# Altium schematic sheet 701_USBHub-Grid-Part2.SchDoc: USB Hub Grid Connections Part 2
size A2; Organization: Greenfield Tech Solutions; Address1: Molendreef 33; Address2: Ossendrecht; Address3: 4641CS; Address4: The Netherlands; SheetNumber: 8; SheetTotal: 9
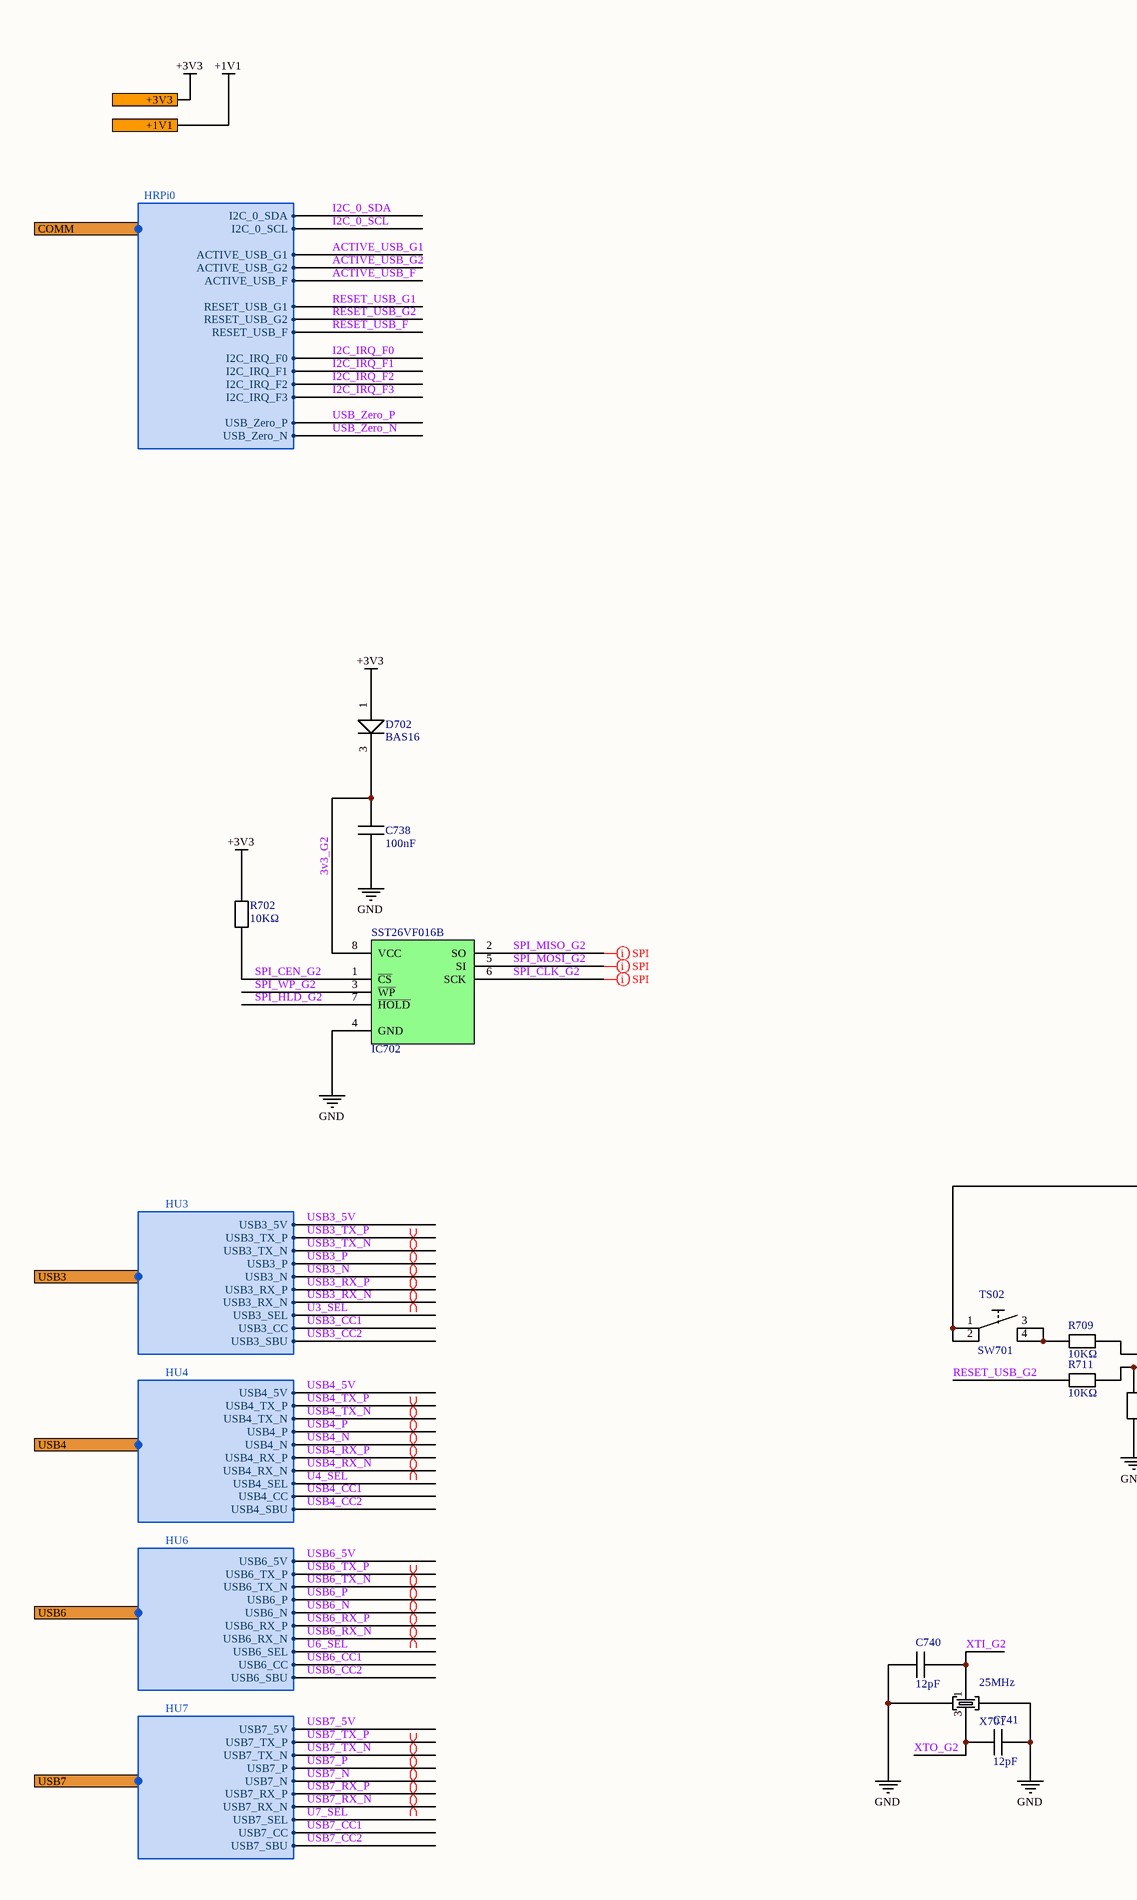
[diagram p0: 701_USBHub-Grid-Part2.SchDoc, left]
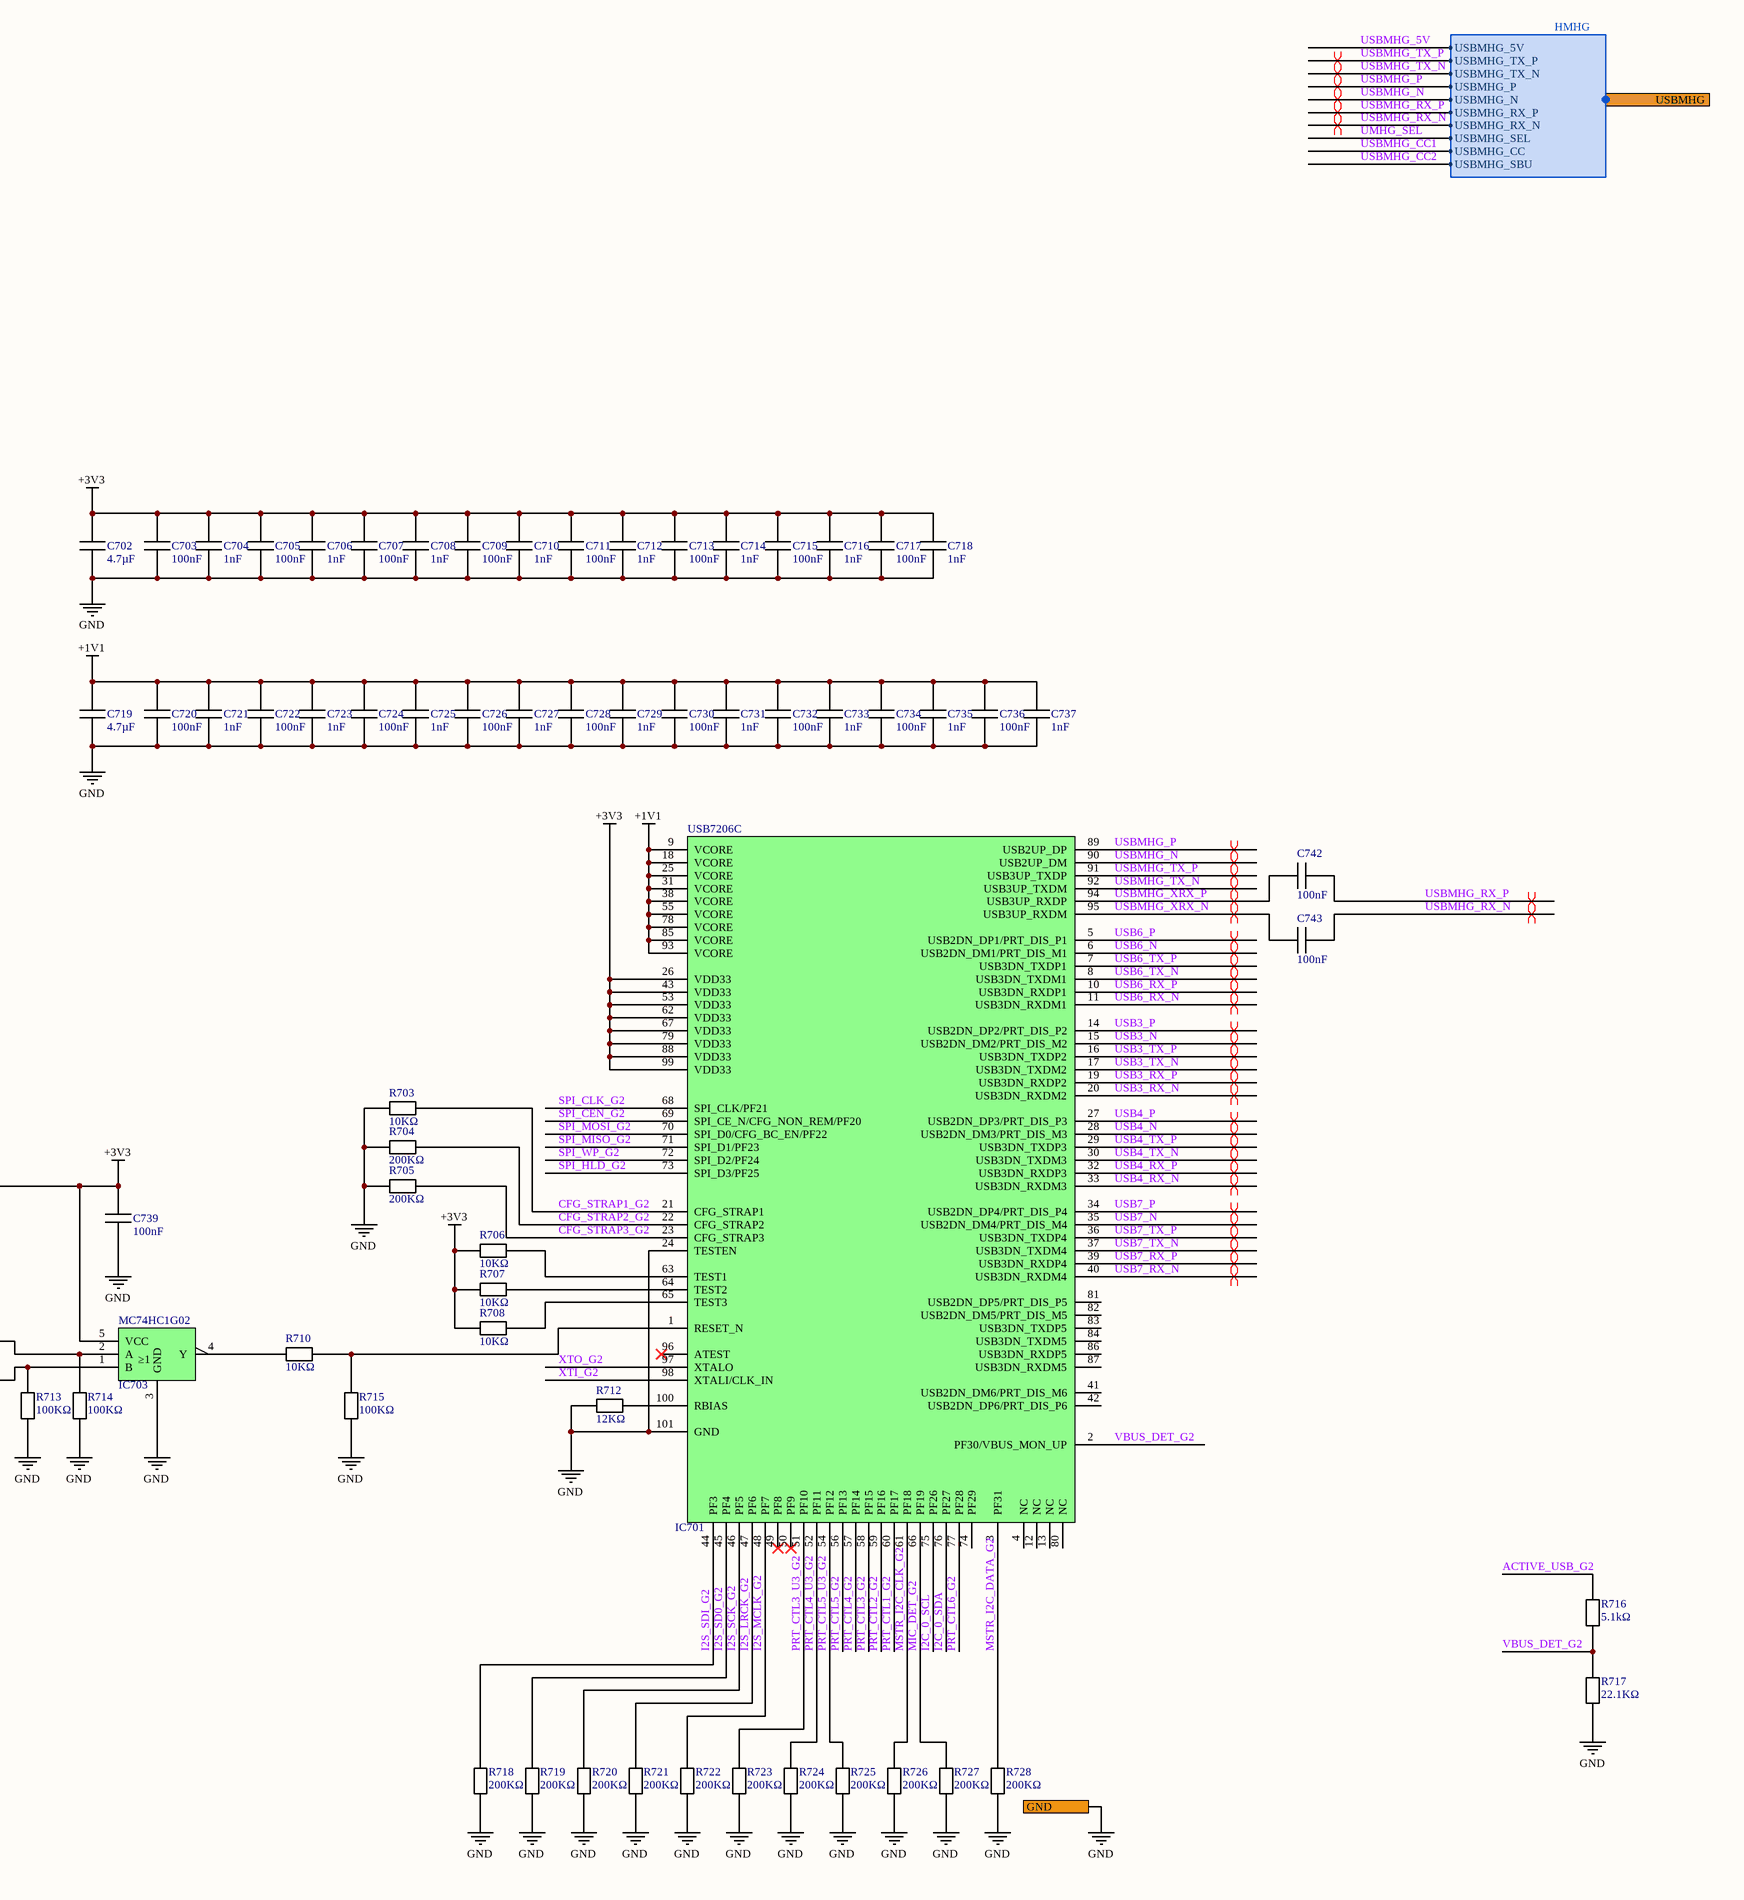
[diagram p1: 701_USBHub-Grid-Part2.SchDoc, right]

## Parts
C702  4.7µF  [C0603]
C703  100nF  [C0402]
C704  1nF  [C0402]
C705  100nF  [C0402]
C706  1nF  [C0402]
C707  100nF  [C0402]
C708  1nF  [C0402]
C709  100nF  [C0402]
C710  1nF  [C0402]
C711  100nF  [C0402]
C712  1nF  [C0402]
C713  100nF  [C0402]
C714  1nF  [C0402]
C715  100nF  [C0402]
C716  1nF  [C0402]
C717  100nF  [C0402]
C718  1nF  [C0402]
C719  4.7µF  [C0603]
C720  100nF  [C0402]
C721  1nF  [C0402]
C722  100nF  [C0402]
C723  1nF  [C0402]
C724  100nF  [C0402]
C725  1nF  [C0402]
C726  100nF  [C0402]
C727  1nF  [C0402]
C728  100nF  [C0402]
C729  1nF  [C0402]
C730  100nF  [C0402]
C731  1nF  [C0402]
C732  100nF  [C0402]
C733  1nF  [C0402]
C734  100nF  [C0402]
C735  1nF  [C0402]
C736  100nF  [C0402]
C737  1nF  [C0402]
C738  100nF  [C0402]
C739  100nF  [C0402]
C740  12pF  [C0402]
C741  12pF  [C0402]
C742  100nF  [C0402]
C743  100nF  [C0402]
D702  BAS16  [SOT-23]
IC701  USB7206C  [VQFN-100G_12X12]
IC702  SST26VF016B  [SO-8]
IC703  MC74HC1G02  [TSOP-5]
R702  10KΩ  [R0402]
R703  10KΩ  [R0402]
R704  200KΩ  [R0402]
R705  200KΩ  [R0402]
R706  10KΩ  [R0402]
R707  10KΩ  [R0402]
R708  10KΩ  [R0402]
R709  10KΩ  [R0402]
R710  10KΩ  [R0402]
R711  10KΩ  [R0402]
R712  12KΩ  [R0402]
R713  100KΩ  [R0402]
R714  100KΩ  [R0402]
R715  100KΩ  [R0402]
R716  5.1kΩ  [R0402]
R717  22.1KΩ  [R0603]
R718  200KΩ  [R0402]
R719  200KΩ  [R0402]
R720  200KΩ  [R0402]
R721  200KΩ  [R0402]
R722  200KΩ  [R0402]
R723  200KΩ  [R0402]
R724  200KΩ  [R0402]
R725  200KΩ  [R0402]
R726  200KΩ  [R0402]
R727  200KΩ  [R0402]
R728  200KΩ  [R0402]
SW701  TS02  [TS02]
X701  25MHz  [403W]

## Ports
+1V1, +3V3, COMM (harness HRPi0), GND, USB3 (harness HU3), USB4 (harness HU4), USB6 (harness HU6), USB7 (harness HU7), USBMHG (harness HMHG)

## Harnesses
HU4: USB4_5V, USB4_TX_P, USB4_TX_N, USB4_N, USB4_RX_P, USB4_RX_N, USB4_SEL, USB4_P, USB4_CC, USB4_SBU
HU7: USB7_5V, USB7_TX_P, USB7_TX_N, USB7_N, USB7_RX_P, USB7_RX_N, USB7_SEL, USB7_P, USB7_CC, USB7_SBU
HU6: USB6_5V, USB6_TX_P, USB6_TX_N, USB6_N, USB6_RX_P, USB6_RX_N, USB6_SEL, USB6_P, USB6_CC, USB6_SBU
HMHG: USBMHG_5V, USBMHG_TX_P, USBMHG_TX_N, USBMHG_N, USBMHG_RX_P, USBMHG_RX_N, USBMHG_SEL, USBMHG_P, USBMHG_CC, USBMHG_SBU
HU3: USB3_5V, USB3_TX_P, USB3_TX_N, USB3_N, USB3_RX_P, USB3_RX_N, USB3_SEL, USB3_P, USB3_CC, USB3_SBU
HRPi0: I2C_0_SCL, I2C_0_SDA, I2C_IRQ_F0, I2C_IRQ_F1, I2C_IRQ_F3, I2C_IRQ_F2, ACTIVE_USB_G1, ACTIVE_USB_F, ACTIVE_USB_G2, RESET_USB_G1, RESET_USB_F, RESET_USB_G2, USB_Zero_N, USB_Zero_P

## Nets
+1V1: C719.1 C720.1 C721.1 C722.1 C723.1 C724.1 C725.1 C726.1 C727.1 C728.1 C729.1 C730.1 C731.1 C732.1 C733.1 C734.1 C735.1 C736.1 C737.1 IC701.9(VCORE) IC701.18(VCORE) IC701.25(VCORE) IC701.31(VCORE) IC701.38(VCORE) IC701.55(VCORE) IC701.78(VCORE) IC701.85(VCORE) IC701.93(VCORE) ; port +1V1
+3V3: C702.1 C703.1 C704.1 C705.1 C706.1 C707.1 C708.1 C709.1 C710.1 C711.1 C712.1 C713.1 C714.1 C715.1 C716.1 C717.1 C718.1 C739.1 D702.1(A) IC701.26(VDD33) IC701.43(VDD33) IC701.53(VDD33) IC701.62(VDD33) IC701.67(VDD33) IC701.79(VDD33) IC701.88(VDD33) IC701.99(VDD33) IC703.5(VCC) R702.2 R706.1 R707.1 R708.1 SW701.1 SW701.2 ; port +3V3
GND: C702.2 C703.2 C704.2 C705.2 C706.2 C707.2 C708.2 C709.2 C710.2 C711.2 C712.2 C713.2 C714.2 C715.2 C716.2 C717.2 C718.2 C719.2 C720.2 C721.2 C722.2 C723.2 C724.2 C725.2 C726.2 C727.2 C728.2 C729.2 C730.2 C731.2 C732.2 C733.2 C734.2 C735.2 C736.2 C737.2 C738.2 C739.2 C740.1 C741.2 IC701.24(TESTEN) IC701.101(GND) IC702.4(GND) IC703.3(GND) R703.2 R704.1 R705.1 R712.1 R713.1 R714.1 R715.1 R717.1 R718.1 R719.1 R720.1 R721.1 R722.1 R723.1 R724.1 R725.1 R726.1 R727.1 R728.1 X701.2 X701.4 ; port GND
3v3_G2: C738.1 D702.3(K) IC702.8(VCC)
ACTIVE_USB_F: port COMM.ACTIVE_USB_F
ACTIVE_USB_G1: port COMM.ACTIVE_USB_G1
ACTIVE_USB_G2: R716.2 ; port COMM.ACTIVE_USB_G2
CFG_STRAP1_G2: IC701.21(CFG_STRAP1) R703.1
CFG_STRAP2_G2: IC701.22(CFG_STRAP2) R704.2
CFG_STRAP3_G2: IC701.23(CFG_STRAP3) R705.2
I2C_0_SCL: IC701.75(PF26) ; port COMM.I2C_0_SCL
I2C_0_SDA: IC701.76(PF27) ; port COMM.I2C_0_SDA
I2C_IRQ_F0: port COMM.I2C_IRQ_F0
I2C_IRQ_F1: port COMM.I2C_IRQ_F1
I2C_IRQ_F2: port COMM.I2C_IRQ_F2
I2C_IRQ_F3: port COMM.I2C_IRQ_F3
I2S_LRCK_G2: IC701.47(PF6) R721.2
I2S_MCLK_G2: IC701.48(PF7) R722.2
I2S_SCK_G2: IC701.46(PF5) R720.2
I2S_SD0_G2: IC701.45(PF4) R719.2
I2S_SDI_G2: IC701.44(PF3) R718.2
MIC_DET_G2: IC701.66(PF19) R727.2
MSTR_I2C_CLK_G2: IC701.61(PF18) R726.2
MSTR_I2C_DATA_G2: IC701.3(PF31) R728.2
PRT_CTL1_G2: IC701.60(PF17)
PRT_CTL2_G2: IC701.59(PF16)
PRT_CTL3_G2: IC701.58(PF15)
PRT_CTL3_U3_G2: IC701.51(PF10) R723.2
PRT_CTL4_G2: IC701.57(PF14)
PRT_CTL4_U3_G2: IC701.52(PF11) R724.2
PRT_CTL5_G2: IC701.56(PF13)
PRT_CTL5_U3_G2: IC701.54(PF12) R725.2
PRT_CTL6_G2: IC701.77(PF28)
RESET_USB_F: port COMM.RESET_USB_F
RESET_USB_G1: port COMM.RESET_USB_G1
RESET_USB_G2: R711.2 ; port COMM.RESET_USB_G2
SPI_CEN_G2: IC701.69(SPI_CE_N/CFG_NON_REM/PF20) IC702.1(~{CS}) R702.1
SPI_CLK_G2: IC701.68(SPI_CLK/PF21) IC702.6(SCK)
SPI_HLD_G2: IC701.73(SPI_D3/PF25) IC702.7(~{HOLD})
SPI_MISO_G2: IC701.71(SPI_D1/PF23) IC702.2(SO)
SPI_MOSI_G2: IC701.70(SPI_D0/CFG_BC_EN/PF22) IC702.5(SI)
SPI_WP_G2: IC701.72(SPI_D2/PF24) IC702.3(~{WP})
U3_SEL: port USB3.USB3_SEL
U4_SEL: port USB4.USB4_SEL
U6_SEL: port USB6.USB6_SEL
U7_SEL: port USB7.USB7_SEL
UMHG_SEL: port USBMHG.USBMHG_SEL
USB3_5V: port USB3.USB3_5V
USB3_CC1: port USB3.USB3_CC
USB3_CC2: port USB3.USB3_SBU
USB3_N: IC701.15(USB2DN_DM2/PRT_DIS_M2) ; port USB3.USB3_N
USB3_P: IC701.14(USB2DN_DP2/PRT_DIS_P2) ; port USB3.USB3_P
USB3_RX_N: IC701.20(USB3DN_RXDM2) ; port USB3.USB3_RX_N
USB3_RX_P: IC701.19(USB3DN_RXDP2) ; port USB3.USB3_RX_P
USB3_TX_N: IC701.17(USB3DN_TXDM2) ; port USB3.USB3_TX_N
USB3_TX_P: IC701.16(USB3DN_TXDP2) ; port USB3.USB3_TX_P
USB4_5V: port USB4.USB4_5V
USB4_CC1: port USB4.USB4_CC
USB4_CC2: port USB4.USB4_SBU
USB4_N: IC701.28(USB2DN_DM3/PRT_DIS_M3) ; port USB4.USB4_N
USB4_P: IC701.27(USB2DN_DP3/PRT_DIS_P3) ; port USB4.USB4_P
USB4_RX_N: IC701.33(USB3DN_RXDM3) ; port USB4.USB4_RX_N
USB4_RX_P: IC701.32(USB3DN_RXDP3) ; port USB4.USB4_RX_P
USB4_TX_N: IC701.30(USB3DN_TXDM3) ; port USB4.USB4_TX_N
USB4_TX_P: IC701.29(USB3DN_TXDP3) ; port USB4.USB4_TX_P
USB6_5V: port USB6.USB6_5V
USB6_CC1: port USB6.USB6_CC
USB6_CC2: port USB6.USB6_SBU
USB6_N: IC701.6(USB2DN_DM1/PRT_DIS_M1) ; port USB6.USB6_N
USB6_P: IC701.5(USB2DN_DP1/PRT_DIS_P1) ; port USB6.USB6_P
USB6_RX_N: IC701.11(USB3DN_RXDM1) ; port USB6.USB6_RX_N
USB6_RX_P: IC701.10(USB3DN_RXDP1) ; port USB6.USB6_RX_P
USB6_TX_N: IC701.8(USB3DN_TXDM1) ; port USB6.USB6_TX_N
USB6_TX_P: IC701.7(USB3DN_TXDP1) ; port USB6.USB6_TX_P
USB7_5V: port USB7.USB7_5V
USB7_CC1: port USB7.USB7_CC
USB7_CC2: port USB7.USB7_SBU
USB7_N: IC701.35(USB2DN_DM4/PRT_DIS_M4) ; port USB7.USB7_N
USB7_P: IC701.34(USB2DN_DP4/PRT_DIS_P4) ; port USB7.USB7_P
USB7_RX_N: IC701.40(USB3DN_RXDM4) ; port USB7.USB7_RX_N
USB7_RX_P: IC701.39(USB3DN_RXDP4) ; port USB7.USB7_RX_P
USB7_TX_N: IC701.37(USB3DN_TXDM4) ; port USB7.USB7_TX_N
USB7_TX_P: IC701.36(USB3DN_TXDP4) ; port USB7.USB7_TX_P
USB_Zero_N: port COMM.USB_Zero_N
USB_Zero_P: port COMM.USB_Zero_P
USBMHG_5V: port USBMHG.USBMHG_5V
USBMHG_CC1: port USBMHG.USBMHG_CC
USBMHG_CC2: port USBMHG.USBMHG_SBU
USBMHG_N: IC701.90(USB2UP_DM) ; port USBMHG.USBMHG_N
USBMHG_P: IC701.89(USB2UP_DP) ; port USBMHG.USBMHG_P
USBMHG_RX_N: C743.2 ; port USBMHG.USBMHG_RX_N
USBMHG_RX_P: C742.2 ; port USBMHG.USBMHG_RX_P
USBMHG_TX_N: IC701.92(USB3UP_TXDM) ; port USBMHG.USBMHG_TX_N
USBMHG_TX_P: IC701.91(USB3UP_TXDP) ; port USBMHG.USBMHG_TX_P
USBMHG_XRX_N: C743.1 IC701.95(USB3UP_RXDM)
USBMHG_XRX_P: C742.1 IC701.94(USB3UP_RXDP)
VBUS_DET_G2: IC701.2(PF30/VBUS_MON_UP) R716.1 R717.2
XTI_G2: C740.2 IC701.98(XTALI/CLK_IN) X701.1
XTO_G2: C741.1 IC701.97(XTALO) X701.3
NetIC701_1: IC701.1(RESET_N) R710.2 R715.2
NetIC701_63: IC701.63(TEST1) R706.2
NetIC701_64: IC701.64(TEST2) R707.2
NetIC701_65: IC701.65(TEST3) R708.2
NetIC701_100: IC701.100(RBIAS) R712.2
NetIC703_1: IC703.1(B) R711.1 R713.2
NetIC703_2: IC703.2(A) R709.1 R714.2
NetIC703_4: IC703.4(Y) R710.1
NetR709_2: R709.2 SW701.3 SW701.4

Not connected (* = marked no-connect by the designer): IC701 4(NC) 12(NC) 13(NC) 41(USB2DN_DM6/PRT_DIS_M6) 42(USB2DN_DP6/PRT_DIS_P6) 49(PF8)* 50(PF9)* 74(PF29) 80(NC) 81(USB2DN_DP5/PRT_DIS_P5) 82(USB2DN_DM5/PRT_DIS_M5) 83(USB3DN_TXDP5) 84(USB3DN_TXDM5) 86(USB3DN_RXDP5) 87(USB3DN_RXDM5) 96(ATEST)*

## Layout directives
differential pair; differential pair class USB3: USB3_N, USB3_P, USB3_RX_N, USB3_RX_P, USB3_TX_N, USB3_TX_P, USB4_N, USB4_P, USB4_RX_N, USB4_RX_P, USB4_TX_N, USB4_TX_P, USB6_N, USB6_P, USB6_RX_N, USB6_RX_P, USB6_TX_N, USB6_TX_P, USB7_N, USB7_P, USB7_RX_N, USB7_RX_P, USB7_TX_N, USB7_TX_P, USBMHG_N, USBMHG_P, USBMHG_RX_N, USBMHG_RX_P, USBMHG_TX_N, USBMHG_TX_P, USBMHG_XRX_N, USBMHG_XRX_P
net class SPI_GRID2: SPI_CLK_G2, SPI_MISO_G2, SPI_MOSI_G2

## Notes on the sheet
- Title
- Size:
- Date:
- File:
- A2
- Number:
- Time:
- Revision:
- Sheet
- of
- (in symbol IC0061) ≥1

## Library data of the parts
C702 C719 = CA0002: 4.7µF 16V 10% X5R; Part Number: CA0002; ManfactPart: C1608X5R1C475K080AC; ID: 2; RefVal: 4.7µF
C703 C705 C707 C709 C711 C713 C715 C717 C720 C722 C724 C726 C728 C730 C732 C734 C736 C738 C739 C742 C743 = CA0010: 100nF 16V 10% X7R; Part Number: CA0010; ManfactPart: GCM155R71C104KA55D; ID: 10; RefVal: 100nF
C704 C706 C708 C710 C712 C714 C716 C718 C721 C723 C725 C727 C729 C731 C733 C735 C737 = CA0031: 1nF 50V 1% C0G; Part Number: CA0031; ManfactPart: GRT1555C1H102FA02D; ID: 31; RefVal: 1nF
C740 C741 = CA0059: 12pF 16V 1% C0G; Part Number: CA0059; ManfactPart: VJ0402A120FXJCW1BC; ID: 59; RefVal: 12pF
D702 = DI0010: Diodes - General Purpose, Power, Switching 100Vll Signal Switching Diodes 2A; Part Number: DI0010; ManfactPart: BAS16_R1_00001; ID: 10; RefVal: BAS16
IC701 = IC0065: 6-Port USB 3.2 Gen 2 Controller Hub; Part Number: IC0065; ID: 65; RefVal: USB7206C; ManfactPart: USB7206C
IC702 = IC0059: 16 Mbit Serial Quad I/O (SQI) Flash Memory; Part Number: IC0059; ManfactPart: SST26VF016B-104I/SM; ID: 59; RefVal: SST26VF016B
IC703 = IC0061: Logic Gates 2-6V Single 2-Input NOR; Part Number: IC0061; ManfactPart: MC74HC1G02DTT1G; ID: 61; RefVal: MC74HC1G02
R702 R703 R706-R711 = RS0011: 10KΩ 1% 62.5mW; Part Number: RS0011; ManfactPart: WR04X1002FTL; ID: 11; RefVal: 10KΩ
R704 R705 R718-R728 = RS0045: 200KΩ 1% 62.5mW 100PPM; Part Number: RS0045; ManfactPart: CRG0402F200K; ID: 45; RefVal: 200KΩ
R712 = RS0015: 12KΩ 1% 62.5mW; Part Number: RS0015; ManfactPart: RC0402FR-1312KL; ID: 15; RefVal: 12KΩ
R713-R715 = RS0036: 100KΩ 1% 62.5mW 100PPM; Part Number: RS0036; ManfactPart: AC0402FR-13100KL; ID: 36; RefVal: 100KΩ
R716 = RS0038: 5.1KΩ 1% 62.5mW 100PPM; Part Number: RS0038; ManfactPart: CRCW04025K10FKEDC; ID: 38; RefVal: 5.1kΩ
R717 = RS0040: 22.1KΩ 1% 100mW 100PPM; Part Number: RS0040; ManfactPart: RC0603FR-0722K1L; ID: 40; RefVal: 22.1KΩ
SW701 = SW0005: TACTILE SWITCH SPST; Part Number: SW0005; ManfactPart: TS02-66-50-BK-160-SCR-D; ID: 5; RefVal: TS02
X701 = CR0003: 25MHz 8pF 20PPM; Part Number: CR0003; ManfactPart: 403WF25012IK; ID: 3; RefVal: 25MHz